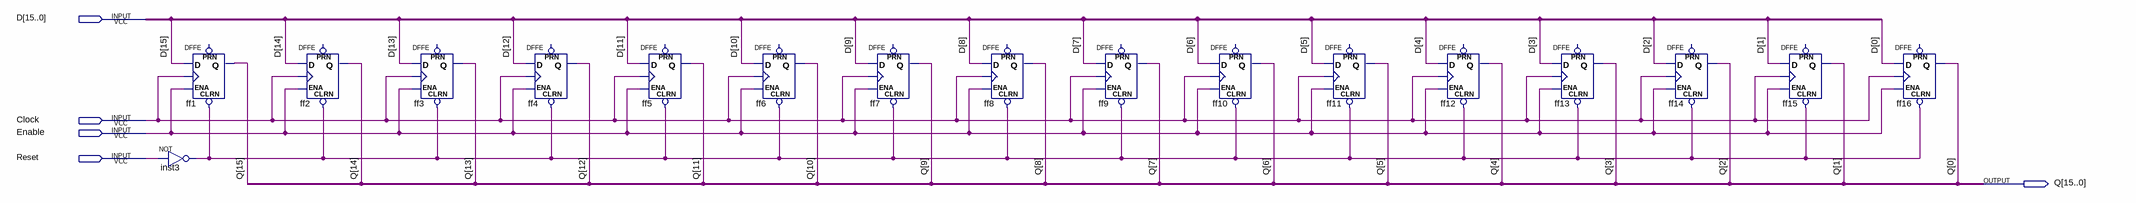
[diagram p0: schematic sheet]
// Quartus schematic register16.bdf as structural Verilog: 17 symbols, 5 pins
module register16 (
  input  [15:0] D,
  input  Clock,
  input  Enable,
  input  Reset,
  output [15:0] Q
);

  wire inst3_out;

  DFFE ff1 (.CLRN(inst3_out), .D(D[15]), .CLK(Clock), .ENA(Enable), .Q(Q[15]));  // open: PRN
  not inst3 (inst3_out, Reset);
  DFFE ff2 (.CLRN(inst3_out), .D(D[14]), .CLK(Clock), .ENA(Enable), .Q(Q[14]));  // open: PRN
  DFFE ff3 (.CLRN(inst3_out), .D(D[13]), .CLK(Clock), .ENA(Enable), .Q(Q[13]));  // open: PRN
  DFFE ff4 (.CLRN(inst3_out), .D(D[12]), .CLK(Clock), .ENA(Enable), .Q(Q[12]));  // open: PRN
  DFFE ff5 (.CLRN(inst3_out), .D(D[11]), .CLK(Clock), .ENA(Enable), .Q(Q[11]));  // open: PRN
  DFFE ff6 (.CLRN(inst3_out), .D(D[10]), .CLK(Clock), .ENA(Enable), .Q(Q[10]));  // open: PRN
  DFFE ff7 (.CLRN(inst3_out), .D(D[9]), .CLK(Clock), .ENA(Enable), .Q(Q[9]));  // open: PRN
  DFFE ff8 (.CLRN(inst3_out), .D(D[8]), .CLK(Clock), .ENA(Enable), .Q(Q[8]));  // open: PRN
  DFFE ff9 (.CLRN(inst3_out), .D(D[7]), .CLK(Clock), .ENA(Enable), .Q(Q[7]));  // open: PRN
  DFFE ff10 (.CLRN(inst3_out), .D(D[6]), .CLK(Clock), .ENA(Enable), .Q(Q[6]));  // open: PRN
  DFFE ff11 (.CLRN(inst3_out), .D(D[5]), .CLK(Clock), .ENA(Enable), .Q(Q[5]));  // open: PRN
  DFFE ff12 (.CLRN(inst3_out), .D(D[4]), .CLK(Clock), .ENA(Enable), .Q(Q[4]));  // open: PRN
  DFFE ff13 (.CLRN(inst3_out), .D(D[3]), .CLK(Clock), .ENA(Enable), .Q(Q[3]));  // open: PRN
  DFFE ff14 (.CLRN(inst3_out), .D(D[2]), .CLK(Clock), .ENA(Enable), .Q(Q[2]));  // open: PRN
  DFFE ff15 (.CLRN(inst3_out), .D(D[1]), .CLK(Clock), .ENA(Enable), .Q(Q[1]));  // open: PRN
  DFFE ff16 (.CLRN(inst3_out), .D(D[0]), .CLK(Clock), .ENA(Enable), .Q(Q[0]));  // open: PRN
endmodule
